# Altium schematic sheet Microcontroller.SchDoc
size A4; SheetNumber: 3; SheetTotal: 4
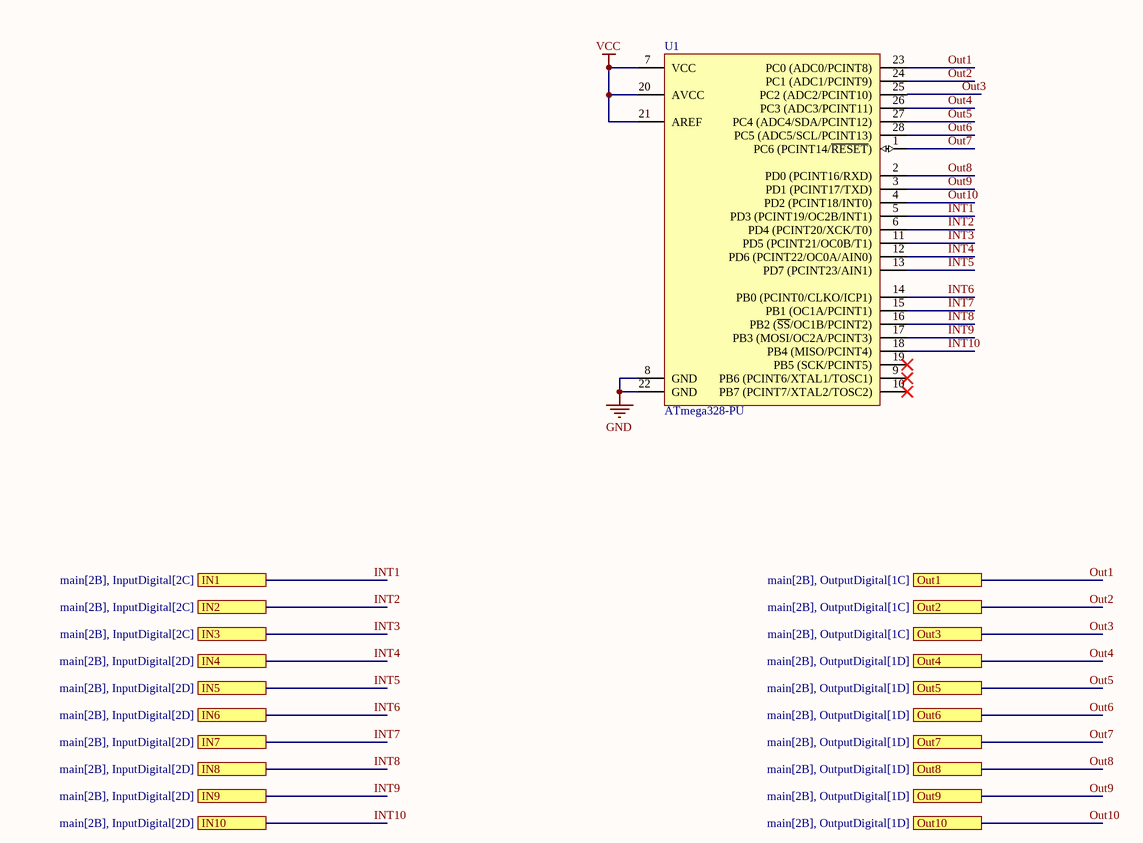
[diagram p0: Microcontroller.SchDoc]

## Parts
U1  ATmega328-PU  [28P3]

## Ports
IN1 (see main[2B], InputDigital[2C]), IN2 (see main[2B], InputDigital[2C]), IN3 (see main[2B], InputDigital[2C]), IN4 (see main[2B], InputDigital[2D]), IN5 (see main[2B], InputDigital[2D]), IN6 (see main[2B], InputDigital[2D]), IN7 (see main[2B], InputDigital[2D]), IN8 (see main[2B], InputDigital[2D]), IN9 (see main[2B], InputDigital[2D]), IN10 (see main[2B], InputDigital[2D]), Out1 (see main[2B], OutputDigital[1C]), Out2 (see main[2B], OutputDigital[1C]), Out3 (see main[2B], OutputDigital[1C]), Out4 (see main[2B], OutputDigital[1D]), Out5 (see main[2B], OutputDigital[1D]), Out6 (see main[2B], OutputDigital[1D]), Out7 (see main[2B], OutputDigital[1D]), Out8 (see main[2B], OutputDigital[1D]), Out9 (see main[2B], OutputDigital[1D]), Out10 (see main[2B], OutputDigital[1D])

## Nets
GND: U1.8(GND) U1.22(GND)
VCC: U1.7(VCC) U1.20(AVCC) U1.21(AREF)
INT1: U1.5(PD3_(PCINT19/OC2B/INT1)) ; port IN1
INT2: U1.6(PD4_(PCINT20/XCK/T0)) ; port IN2
INT3: U1.11(PD5_(PCINT21/OC0B/T1)) ; port IN3
INT4: U1.12(PD6_(PCINT22/OC0A/AIN0)) ; port IN4
INT5: U1.13(PD7_(PCINT23/AIN1)) ; port IN5
INT6: U1.14(PB0_(PCINT0/CLKO/ICP1)) ; port IN6
INT7: U1.15(PB1_(OC1A/PCINT1)) ; port IN7
INT8: U1.16(PB2_(~{SS}/OC1B/PCINT2)) ; port IN8
INT9: U1.17(PB3_(MOSI/OC2A/PCINT3)) ; port IN9
INT10: U1.18(PB4_(MISO/PCINT4)) ; port IN10
Out1: U1.23(PC0_(ADC0/PCINT8)) ; port Out1
Out2: U1.24(PC1_(ADC1/PCINT9)) ; port Out2
Out3: U1.25(PC2_(ADC2/PCINT10)) ; port Out3
Out4: U1.26(PC3_(ADC3/PCINT11)) ; port Out4
Out5: U1.27(PC4_(ADC4/SDA/PCINT12)) ; port Out5
Out6: U1.28(PC5_(ADC5/SCL/PCINT13)) ; port Out6
Out7: U1.1(PC6_(PCINT14/~{RESET})) ; port Out7
Out8: U1.2(PD0_(PCINT16/RXD)) ; port Out8
Out9: U1.3(PD1_(PCINT17/TXD)) ; port Out9
Out10: U1.4(PD2_(PCINT18/INT0)) ; port Out10

Not connected (* = marked no-connect by the designer): U1 9(PB6_(PCINT6/XTAL1/TOSC1))* 10(PB7_(PCINT7/XTAL2/TOSC2))* 19(PB5_(SCK/PCINT5))*

## Library data of the parts
U1 = CMP-0095-00015-2: 8-bit AVR Microcontroller, 32KB Flash, 1KB EEPROM, 2KB SRAM, 28-pin PDIP, Industrial Grade (-40°C to 85°C); ComponentLink3Description: ATmega48A/48PA/88A/88PA/168A/168PA/328/328P Summary; RevisionNote: DatasheetVersion updated. URLs added.; DatasheetVersion: revD, May-2011; ComponentLink1URL: http://www.atmel.com/; PackageVersion: revB, Sep-2001; PackageDescription: 28-lead (0.300"/7.62mm Wide) Plastic Dual Inline Package (PDIP); PackageReference: 28P3; ComponentLink1Description: Manufacturer URL; ComponentLink2Description: ATmega48A/48PA/88A/88PA/168A/168PA/328/328P Datasheet; ComponentLink3URL: http://www.atmel.com/dyn/resources/prod_documents/8271S.pdf; ComponentLink2URL: http://www.atmel.com/dyn/resources/prod_documents/8271.pdf